# Altium schematic sheet 0006_BLOCK DIAGRAM - PO.SchDoc
size 848 x 558 mm
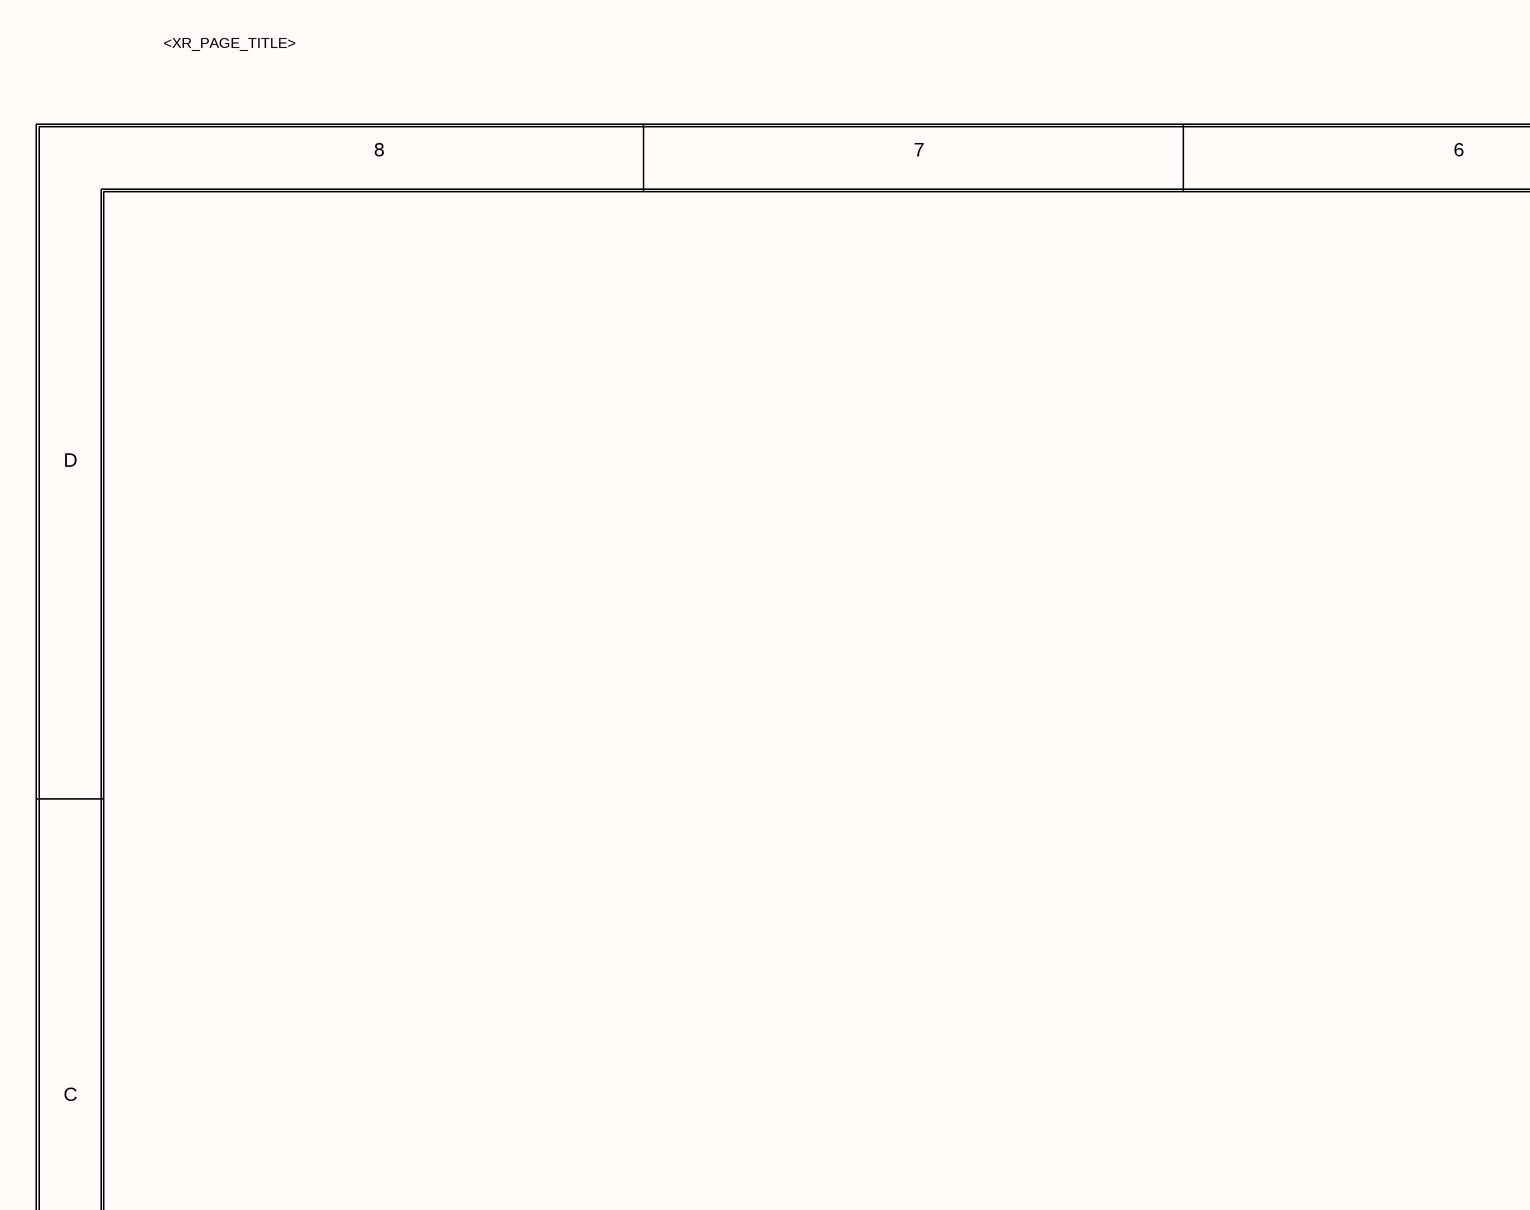
[diagram p0: 0006_BLOCK DIAGRAM - PO.SchDoc, top left]
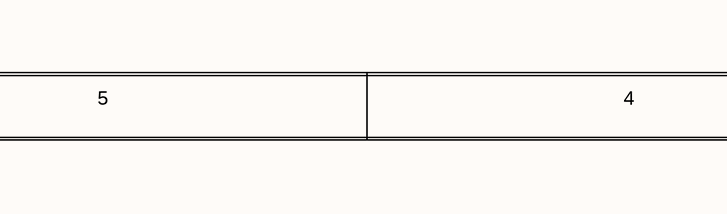
[diagram p1: 0006_BLOCK DIAGRAM - PO.SchDoc, top middle]
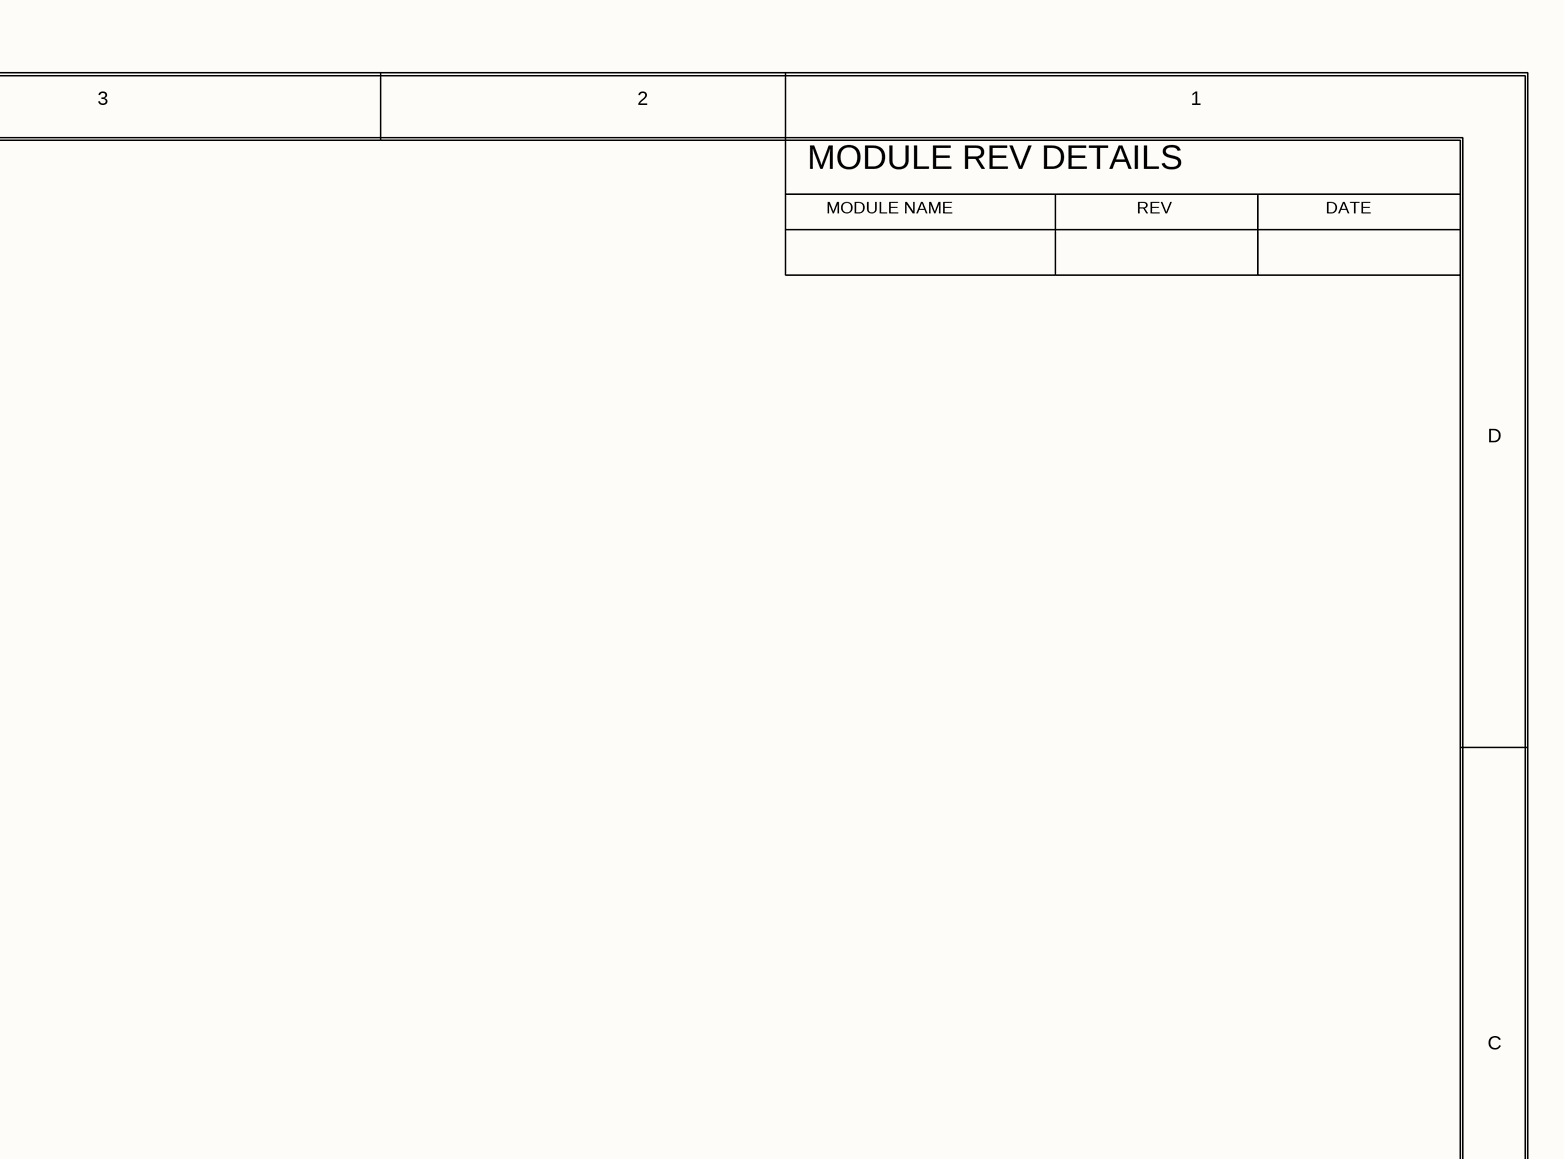
[diagram p2: 0006_BLOCK DIAGRAM - PO.SchDoc, top right]
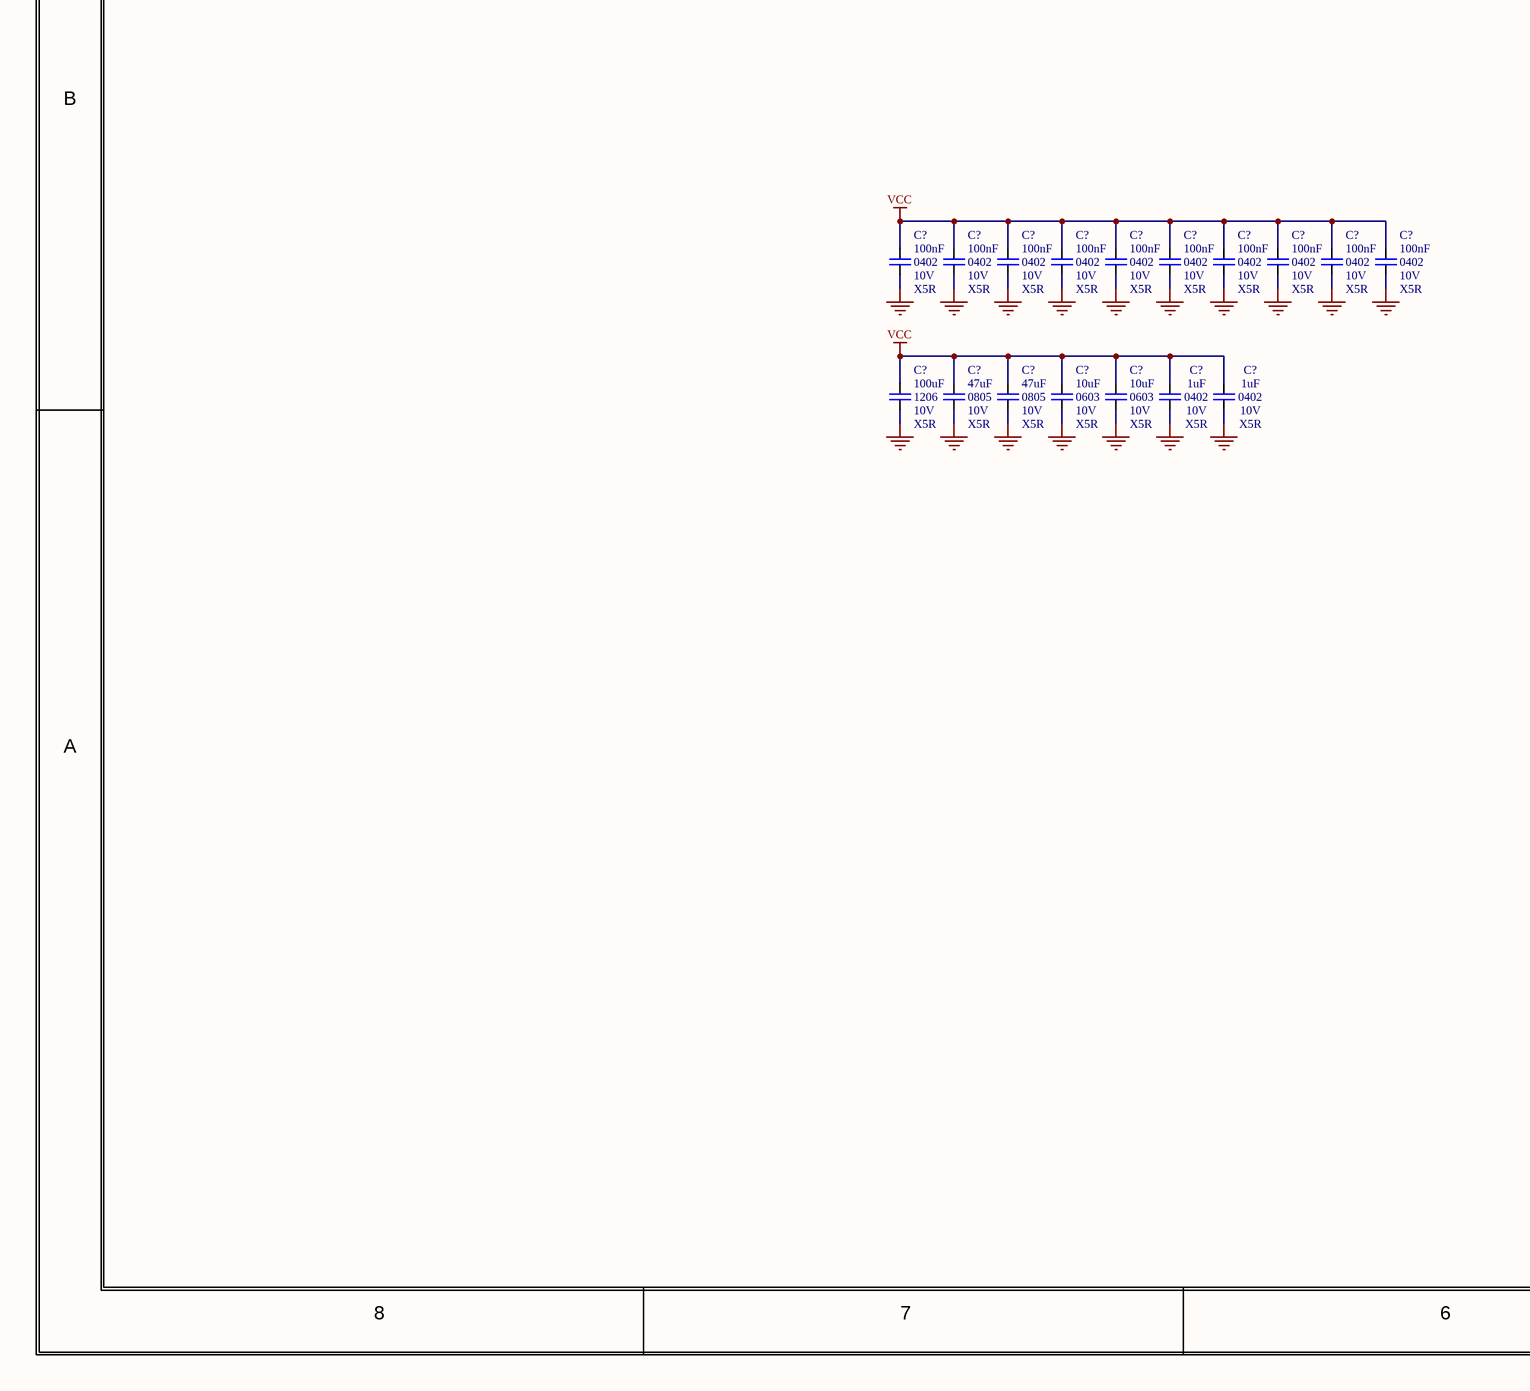
[diagram p3: 0006_BLOCK DIAGRAM - PO.SchDoc, bottom left]
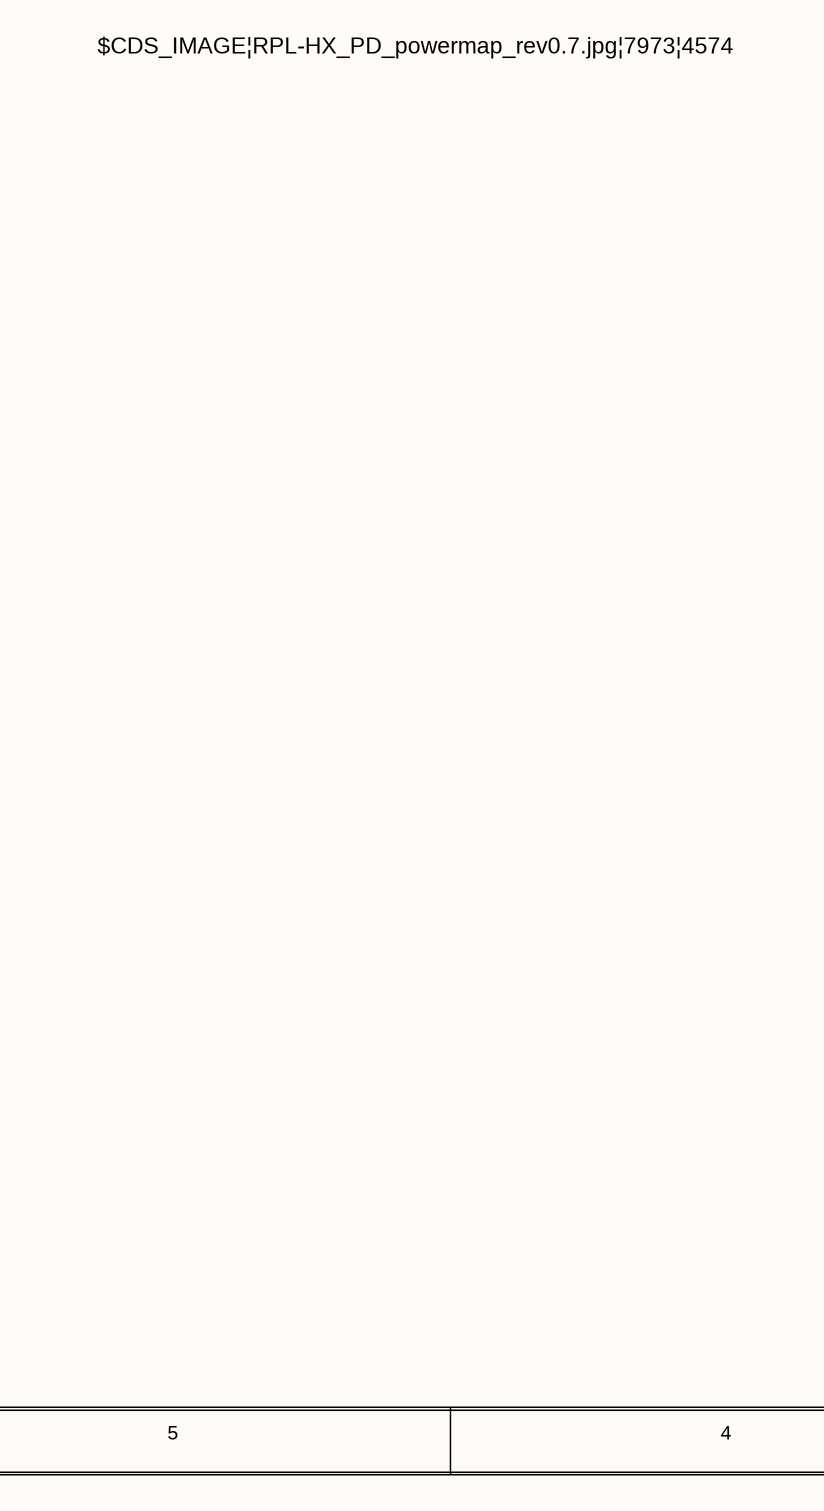
[diagram p4: 0006_BLOCK DIAGRAM - PO.SchDoc, bottom middle]
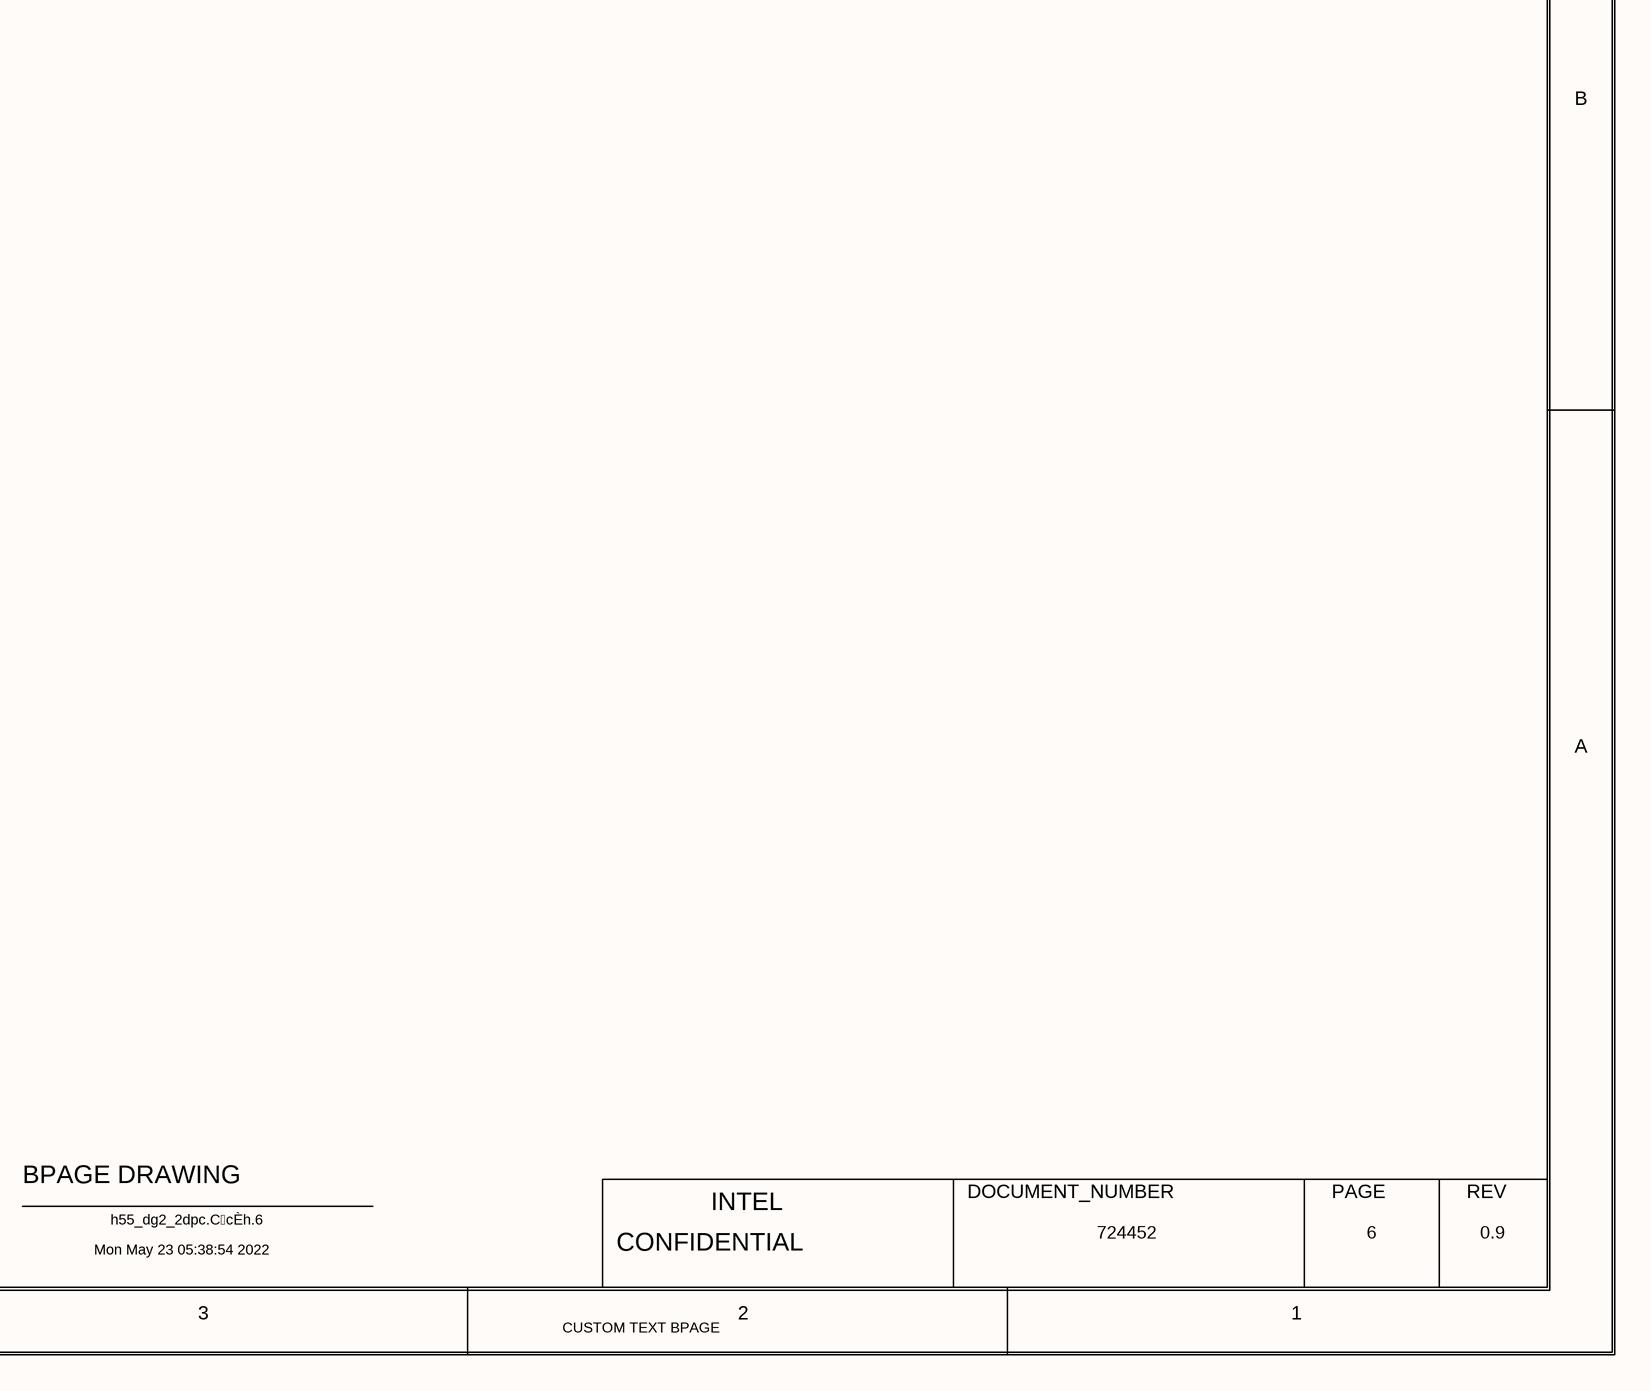
[diagram p5: 0006_BLOCK DIAGRAM - PO.SchDoc, bottom right]

## Parts
(Parts that share a designator on the sheet are numbered #1, #2 ... from top to bottom, then left to right.)
C?#1  value 100nF  Case/Package: 0402  Voltage: 10V  Dielectric: X5R  [CAPC0402]
C?#2  value 100nF  Case/Package: 0402  Voltage: 10V  Dielectric: X5R  [CAPC0402]
C?#3  value 100nF  Case/Package: 0402  Voltage: 10V  Dielectric: X5R  [CAPC0402]
C?#4  value 100nF  Case/Package: 0402  Voltage: 10V  Dielectric: X5R  [CAPC0402]
C?#5  value 100nF  Case/Package: 0402  Voltage: 10V  Dielectric: X5R  [CAPC0402]
C?#6  value 100nF  Case/Package: 0402  Voltage: 10V  Dielectric: X5R  [CAPC0402]
C?#7  value 100nF  Case/Package: 0402  Voltage: 10V  Dielectric: X5R  [CAPC0402]
C?#8  value 100nF  Case/Package: 0402  Voltage: 10V  Dielectric: X5R  [CAPC0402]
C?#9  value 100nF  Case/Package: 0402  Voltage: 10V  Dielectric: X5R  [CAPC0402]
C?#10  value 100nF  Case/Package: 0402  Voltage: 10V  Dielectric: X5R  [CAPC0402]
C?#11  value 100uF  Case/Package: 1206  Voltage: 10V  Dielectric: X5R
C?#12  value 47uF  Case/Package: 0805  Voltage: 10V  Dielectric: X5R  [capc0805]
C?#13  value 47uF  Case/Package: 0805  Voltage: 10V  Dielectric: X5R  [capc0805]
C?#14  value 10uF  Case/Package: 0603  Voltage: 10V  Dielectric: X5R  [CAPC0603]
C?#15  value 10uF  Case/Package: 0603  Voltage: 10V  Dielectric: X5R  [CAPC0603]
C?#16  value 1uF  Case/Package: 0402  Voltage: 10V  Dielectric: X5R  [CAPC0402]
C?#17  value 1uF  Case/Package: 0402  Voltage: 10V  Dielectric: X5R  [CAPC0402]

## Nets
GND: C?#1.2 C?#2.2 C?#3.2 C?#4.2 C?#5.2 C?#6.2 C?#7.2 C?#8.2 C?#9.2 C?#10.2 C?#11.1 C?#12.1 C?#13.1 C?#14.1 C?#15.1 C?#16.1 C?#17.1
VCC: C?#1.1 C?#2.1 C?#3.1 C?#4.1 C?#5.1 C?#6.1 C?#7.1 C?#8.1 C?#9.1 C?#10.1 C?#11.2 C?#12.2 C?#13.2 C?#14.2 C?#15.2 C?#16.2 C?#17.2

## Notes on the sheet
- <XR_PAGE_TITLE>
- 8
- 7
- 6
- 5
- 4
- 3
- 2
- 1
- MODULE REV DETAILS
- MODULE NAME
- REV
- DATE
- D
- C
- $CDS_IMAGE|RPL-HX_PD_powermap_rev0.7.jpg|7973|4574
- B
- A
- BPAGE DRAWING
- INTEL
- DOCUMENT_NUMBER
- PAGE
- Mon May 23 05:38:54 2022
- h55_dg2_2dpc.CcÈh.6
- CONFIDENTIAL
- 724452
- 0.9
- CUSTOM TEXT BPAGE

## Library data of the parts
C?#1-C?#10 = Cap: CAP CER 100nF 10V X5R 0402
C?#11 = Cap: CAP CER 100uF 10V X5R 1206
C?#12 C?#13 = Cap: CAP CER 47uF 10V X5R 0805
C?#14 C?#15 = Cap: CAP CER 10uF 10V X5R 0603
C?#16 C?#17 = Cap: CAP CER 1uF 10V X5R 0402